# EAGLE design pluginboard_BBreaker (EAGLE 9.2.2)
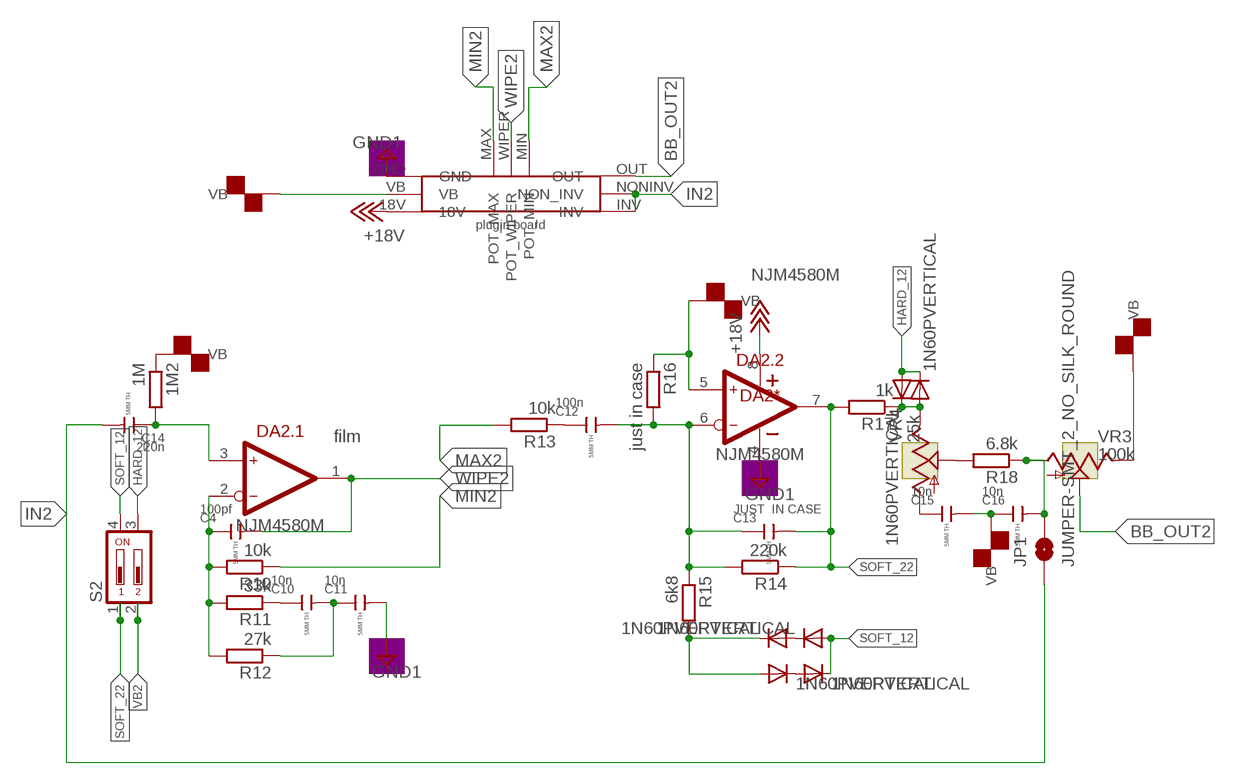
[diagram p0: schematic, sheet 1]

## Parts
1M2  1M  R-EU_R1206  [R1206]
C4  100pf  THRU_HOLE_5MM_SPACING  [CERAMIC-5MM]
C10  10n  THRU_HOLE_5MM_SPACING  [CERAMIC-5MM]
C11  10n  THRU_HOLE_5MM_SPACING  [CERAMIC-5MM]
C12  100n  THRU_HOLE_5MM_SPACING  [CERAMIC-5MM]
C13  JUST IN CASE  THRU_HOLE_5MM_SPACING  [CERAMIC-5MM]
C14  220n  THRU_HOLE_5MM_SPACING  [CERAMIC-5MM]
C15  10n  THRU_HOLE_5MM_SPACING  [CERAMIC-5MM]
C16  10n  THRU_HOLE_5MM_SPACING  [CERAMIC-5MM]
DA2  NJM4580M  [SO-8]
JP1  JUMPER-SMT_2_NO_SILK_ROUND  [SMT-JUMPER_2_NO_SILK_ROUND]
R10  10k  R-EU_R1206  [R1206]
R11  33k  R-EU_R1206  [R1206]
R12  27k  R-EU_R1206  [R1206]
R13  10k  R-EU_R1206  [R1206]
R14  220k  R-EU_R1206  [R1206]
R15  6k8  R-EU_R1206  [R1206]
R16  just in case  R-EU_R1206  [R1206]
R17  1k  R-EU_R1206  [R1206]
R18  6.8k  R-EU_R1206  [R1206]
S2  DP02  [DP-02]
U$13  1N60PVERTICAL  [DO41-1]
U$14  1N60PVERTICAL  [DO41-1]
U$15  1N60PVERTICAL  [DO41-1]
U$16  1N60PVERTICAL  [DO41-1]
U$20  1N60PVERTICAL  [DO41-1]
U$21  1N60PVERTICAL  [DO41-1]
U$22  GT_BOARD  [PLUGIN_BOARD]
VR3  100k  TRIM_US-3223G  [3223G]
VR4  25k  TRIM_US-3223G  [3223G]

## Nets
+18V2: DA2.8(*:V+) U$22.18V ; supply symbol labelled +18V
BB_OUT2: U$22.OUT VR3.2(S)
GND12: C11.2 DA2.4(*:V-) U$22.GND ; supply symbol labelled GND1
HARD_12: S2.3 U$20.A U$21.C
IN2: C14.2 JP1.1 U$22.INV U$22.NONINV(NON_INV)
MAX2: R13.2 U$22.MIN(POT_MIN)
MIN2: R10.1 U$22.MAX(POT_MAX)
N$3: C10.1 R11.1
N$15: C10.2 C11.1 R12.1
N$16: C12.1 R13.1
N$17: C12.2 C13.1 DA2.6(.2:IN-) R14.2 R15.1 R16.2
N$18: U$13.C U$14.A
N$19: U$15.C U$16.A
N$20: R15.2 U$14.C U$15.A
N$21: C4.1 DA2.2(.1:IN-) R10.2 R11.2 R12.2
N$22: R17.1 U$20.C U$21.A VR4.3(E)
N$23: 1M2.2 C14.1 DA2.3(.1:IN+)
N$24: R18.2 VR4.2(S)
N$25: C16.2 JP1.2 R18.1 VR3.1(A)
N$26: C15.1 VR4.1(A)
SOFT_12: S2.4 U$13.A U$16.C
SOFT_22: C13.2 DA2.7(.2:OUT) R14.1 R17.2 S2.1
VB2: 1M2.1 C15.2 C16.1 DA2.5(.2:IN+) R16.1 S2.2 U$22.VB VR3.3(E) ; supply symbol labelled VB
WIPE2: C4.2 DA2.1(.1:OUT) U$22.WIPER(POT_WIPER)

## Notes on the sheet
- film

## Library data of the parts
1M2 R10-R18 = resistor:R-EU_: RESISTOR, European symbol
C4 C10-C16 = GT_Capacitor:THRU_HOLE_5MM_SPACING: 302010202; PACKAGE: 5MM TH
DA2 = ic-jrc:NJM4580; MOUSER: 513-NJM4580M
JP1 = SparkFun-Jumpers:JUMPER-SMT_2_NO: Normally open jumper This jumper has two pads in close proximity to each other. Apply solder to close the connection. Round pads are easier to solder for beginners, but are a lot larger. SparkFun Product that uses the round pads: SparkFun EL Sequencer <https://www.sparkfun.com/products/12781>
S2 = switch-dil:DP02: DIL/CODE SWITCH; MPN: MCDP02; OC_FARNELL: 1255233; OC_NEWARK: 26M1095
U$13-U$16 U$20 U$21 = diode:1N60P
U$22 = BluePill:GT_BOARD
VR3 VR4 = pot:TRIM_US-: POTENTIOMETER

## Board
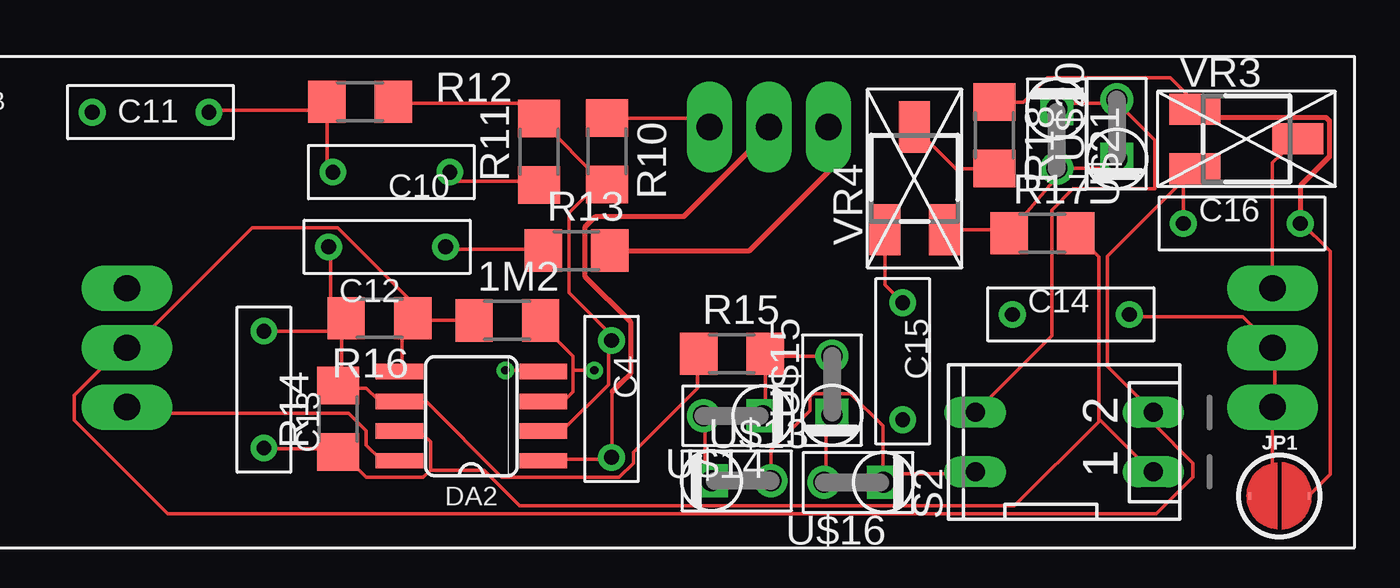
[diagram p1: board, top side]
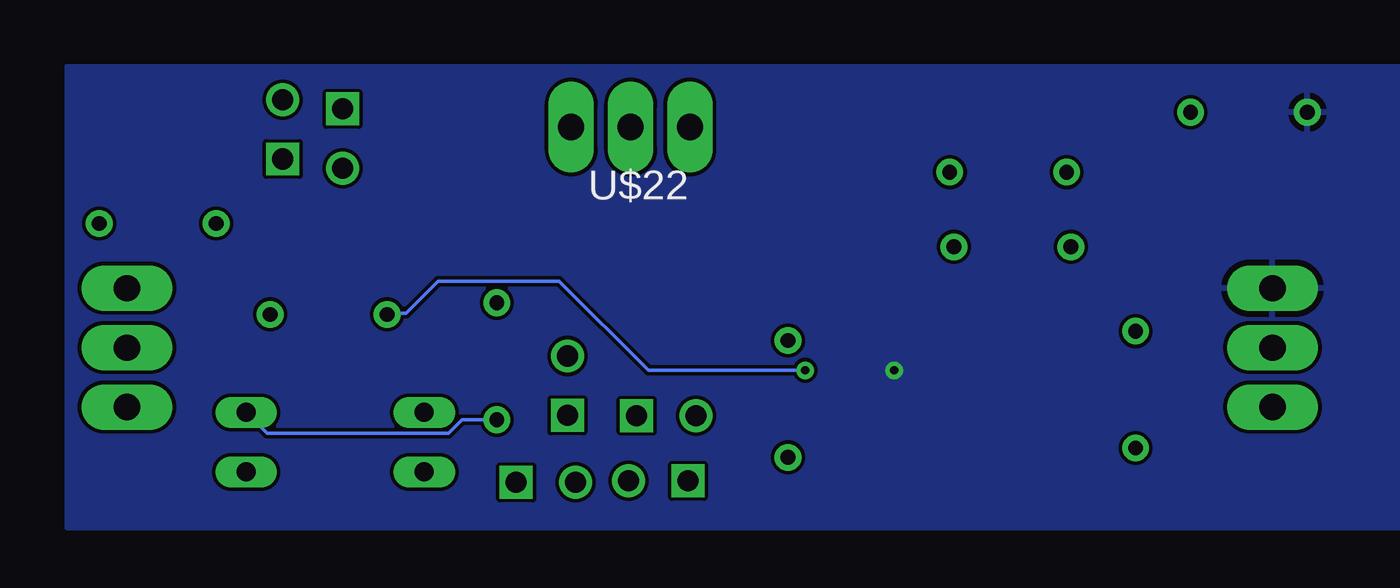
[diagram p2: board, bottom side, seen from below]

No outline drawn. Coordinates in mm, seen from the top.
Copper layers (1*16): Top 0.035mm / dielectric 1.5mm / Bottom 0.035mm
Design rules "default": minimum track width 6mil, minimum drill 0.35mm, track to track 6mil, track to pad 6mil, pad to pad 6mil, via to via 6mil, smd to smd 6mil, copper to edge 40mil, drill to drill 6mil, minimum pad ring 10mil, minimum via ring 8mil, stop-mask expansion 4mil, vias tented up to drill 0mil, thermal gap 10mil

### Footprints (pad centres in the part's own frame; a part is rotated, then mirrored left to right if it is on the bottom)
R1206 = smd 1.6 x 1.803: 1 -1.422,0; 2 1.422,0
CERAMIC-5MM = drill 0.635 pad 1.143: 1 -2.5,0; 2 2.5,0
SO-8 = smd 0.66 x 2.032: 1 -1.905,-3.073; 2 -0.635,-3.073; 3 0.635,-3.073; 4 1.905,-3.073; 5 1.905,3.073; 6 0.635,3.073; 7 -0.635,3.073; 8 -1.905,3.073
SMT-JUMPER_2_NO_SILK_ROUND = smd 0.152 x 0.305: 1 -1.27,0; 2 1.27,0
DP-02 = drill 0.813 long: 1 -1.27,-3.81; 2 1.27,-3.81; 3 1.27,3.81; 4 -1.27,3.81
DO41-1 = drill 0.9: A 1.27,0 | drill 0.9 square: C -1.27,0
PLUGIN_BOARD = drill 1.118 pad 1.956 long: 18V -27.511,0.017; GND -27.511,5.097; INV 21.489,0.017; MAX -2.591,11.989; MIN 2.489,11.989; NONINV 21.489,2.557; OUT 21.489,5.097; VB -27.511,2.557; WIPER -0.051,11.989
3223G = smd 2.184 x 1.321: 1 -2.2,1.273; 2 2.2,0; 3 -2.2,-1.273

### Placement (x,y rotation side)
1M2  26.21,66.37 0 top
C4  30.67,63.02 270 top
C10  21.25,72.72 180 top
C11  10.95,75.28 180 top
C12  21.07,69.52 180 top
C13  15.8,63.42 270 top
C14  50.32,66.63 0 top
C15  43.12,64.63 270 top
C16  57.63,70.52 0 top
DA2  24.67,62.28 90 top
JP1  59.23,58.87 0 top
R10  30.47,73.61 270 top
R11  27.56,73.59 90 top
R12  19.92,75.73 0 top
R13  29.17,69.36 0 top
R14  18.98,62.17 90 top
R15  35.82,64.95 0 top
R16  20.74,66.47 180 top
R17  49.11,70.1 0 top
R18  47.05,74.29 270 top
S2  50.03,61.17 90 top
U$13  36.22,59.52 0 top
U$14  35.87,62.3 180 top
U$15  40.1,63.58 90 top
U$16  41.02,59.45 180 top
U$20  52.28,74.55 90 top
U$21  49.72,74.15 270 top
U$22  37.45,62.66 0 top
VR3  57.83,74.14 0 top
VR4  43.63,72.45 90 top

### Tracks (layer width: path | path; a pad name or v marks a point on that pad's centre or on a via)
+18V2
  Top 0.152: DA2.8 21.55,60.43 20.79,60.43 20.18,61.04 20.18,61.65 19.42,62.41 10.12,62.41 9.97,62.56 U$22.18V
BB_OUT2
  Top 0.152: VR3.2 58.94,73.12 58.94,67.94 59.04,67.9 U$22.OUT
GND12  (via drill 0.35)
  Top 0.152: v26.12,64.24 27.65,64.24 DA2.4
  pour Bottom: 1.08,77.23 61.53,77.23 61.53,57.52 1.08,57.52
HARD_12
  Top 0.152: 46.24,62.56 S2.3 49.5,65.72 49.5,71.09 50.41,72.01 53.91,72.01 53.91,74.08 52.24,75.76 | 49.59,75.36 U$21.C | 52.24,75.76 52.18,75.67 49.9,75.67 49.74,75.52 U$21.C | 52.24,75.76 U$20.A | 49.64,75.43 U$21.C
IN2
  Top 0.152: C14.2 52.95,66.53 57.67,66.53 58.89,65.31 U$22.NONINV 59.04,65.15 59.04,62.72 U$22.INV 58.94,59.85 JP1.1
MAX2
  Top 0.152: 30.7,69.47 R13.2
  Top 0.203: R13.2 36.58,69.36 39.94,72.73 U$22.MIN
MIN2
  Top 0.152: 30.54,74.91 R10.1 34.48,75.03 U$22.MAX
N$3
  Top 0.152: R11.1 27.49,72.32 24.14,72.32 23.84,72.62 C10.1
N$15
  Top 0.152: 18.5,75.36 18.5,72.93 18.66,72.77 C10.2 | 18.5,75.36 18.5,75.67 R12.1 18.5,75.36 | 18.5,75.36 13.47,75.36 C11.1
N$16
  Top 0.152: R13.1 27.65,69.42 23.68,69.42 C12.1
N$17
  Top 0.152: 19.11,65.92 19.11,66.22 19.27,66.37 R16.2 | 19.11,65.92 19.11,63.63 R14.2 19.11,63.48 20.18,63.48 20.64,63.02 21.55,63.02 DA2.6 21.7,62.87 22.77,62.87 25.97,59.67 31,59.67 31.61,60.28 31.61,60.73 34.35,63.48 34.35,64.85 R15.1 | 19.11,65.92 15.91,65.92 C13.1 | 19.11,65.92 R16.2 | C12.2 18.66,69.42 18.66,67.14 19.27,66.53 R16.2
N$18
  Top 0.152: U$14.A 34.66,62.26 34.66,59.8 U$13.C
N$19
  Top 0.152: U$16.A 39.84,59.48 39.84,62.11 39.99,62.26 U$15.C
N$20
  Top 0.152: 37.25,64.85 37.25,62.41 U$14.C | 37.25,64.85 39.99,64.85 U$15.A | 37.25,64.85 R15.2
N$21
  Top 0.152: DA2.2 27.8,61.65 28.56,61.65 30.54,63.63 30.54,65.46 C4.1 30.54,65.61 30.54,65.88 28.86,67.56 28.86,70.97 30.22,72.34 | 30.22,72.34 30.39,72.17 R10.2 | 30.22,72.34 27.65,74.91 R11.2 27.49,75.06 26.89,75.67 21.4,75.67 R12.2
N$22
  Top 0.152: U$21.A | U$21.A 51.88,72.88 U$20.C | R17.1 47.75,70.18 | 47.75,70.18 49.9,72.7 U$21.A | VR4.3 47.69,70.25 47.75,70.18
N$23  (via drill 0.35)
  Top 0.152: 29.02,64.24 29.02,63.33 28.71,63.02 27.8,63.02 DA2.3 | 29.02,64.24 29.02,64.85 27.65,66.22 1M2.2 | 29.02,64.24 v29.93,64.24
  Bottom 0.152: v29.93,64.24 36.64,64.24 40.45,68.05 45.63,68.05 47,66.68 47.76,66.68 C14.1
N$24
  Top 0.152: VR4.2 45.41,72.87 R18.2
N$25
  Top 0.152: R18.1 48.28,75.71 49.32,76.75 54.58,76.75 55.63,75.7 VR3.1 55.92,75.41 56.05,75.28 56.05,75.07 | JP1.2 61.42,59.79 61.42,69.33 61.41,69.33 60.13,70.6
  Top 0.203: VR3.1 55.99,75.05 61.23,75.05 61.38,74.91 61.38,73.37 60.13,72.13 60.13,70.6 C16.2
N$26
  Top 0.152: C15.1 42.36,67.89 VR4.1
SOFT_12
  Top 0.152: S2.4 46.09,59.82 42.89,59.82 42.28,59.21 42.28,59.42 | 42.28,59.42 U$16.C 42.16,59.34 | 37.58,59.47 U$13.A 37.49,60.84 39.17,62.52 39.17,63.11 39.3,63.25 39.89,63.25 40.01,63.37 40.14,63.25 40.9,63.25 42.28,61.87 42.28,59.42
SOFT_22
  Top 0.152: C13.2 15.91,60.89 18.96,60.89 R14.1 19.11,60.73 20.18,59.67 22.62,59.67 22.92,59.97 | 22.92,59.97 22.92,61.19 22.62,61.5 21.7,61.5 DA2.7 | S2.1 53.71,59.97 51.57,62.11 51.52,62.05 | 22.92,59.97 25.21,59.97 26.74,58.44 47.91,58.44 51.52,62.05 | R17.2 51.52,69.11 51.52,62.05
VB2
  Top 0.152: 1M2.1 24.75,66.37 22.31,66.37 R16.1 | DA2.5 21.7,64.24 21.7,65.92 22.16,66.37 R16.1 | R16.1 22.16,66.53 22.16,67.14 18.96,70.34 15.3,70.34 10.27,65.31 9.97,65.31 U$22.VB 9.82,65.31 7.68,63.17 7.68,62.11 11.69,58.1 53.97,58.1 55.54,59.67 55.54,60.28 53.86,61.95 53.86,62.41 S2.2 51.88,64.41 51.88,69.12 VR3.3 | C16.1 55.13,72.37
  Top 0.203: 55.13,72.37 VR3.3
  Bottom 0.152: C15.2 44.62,62.13 45.2,61.55 52.95,61.55 S2.2
WIPE2
  Top 0.152: DA2.1 27.8,60.43 30.54,60.43 C4.2 30.7,60.55 30.7,63.33
  Top 0.203: 30.7,63.33 31.08,63.71 31.49,64.12 31.49,66.29 29.54,68.25 29.54,70.37 29.99,70.83 33.76,70.83 37.4,74.46 U$22.WIPER

### Text on the board
tPlace: GTBB